# EAGLE schematic BSPD 5 11_27 (EAGLE 8.4.1)
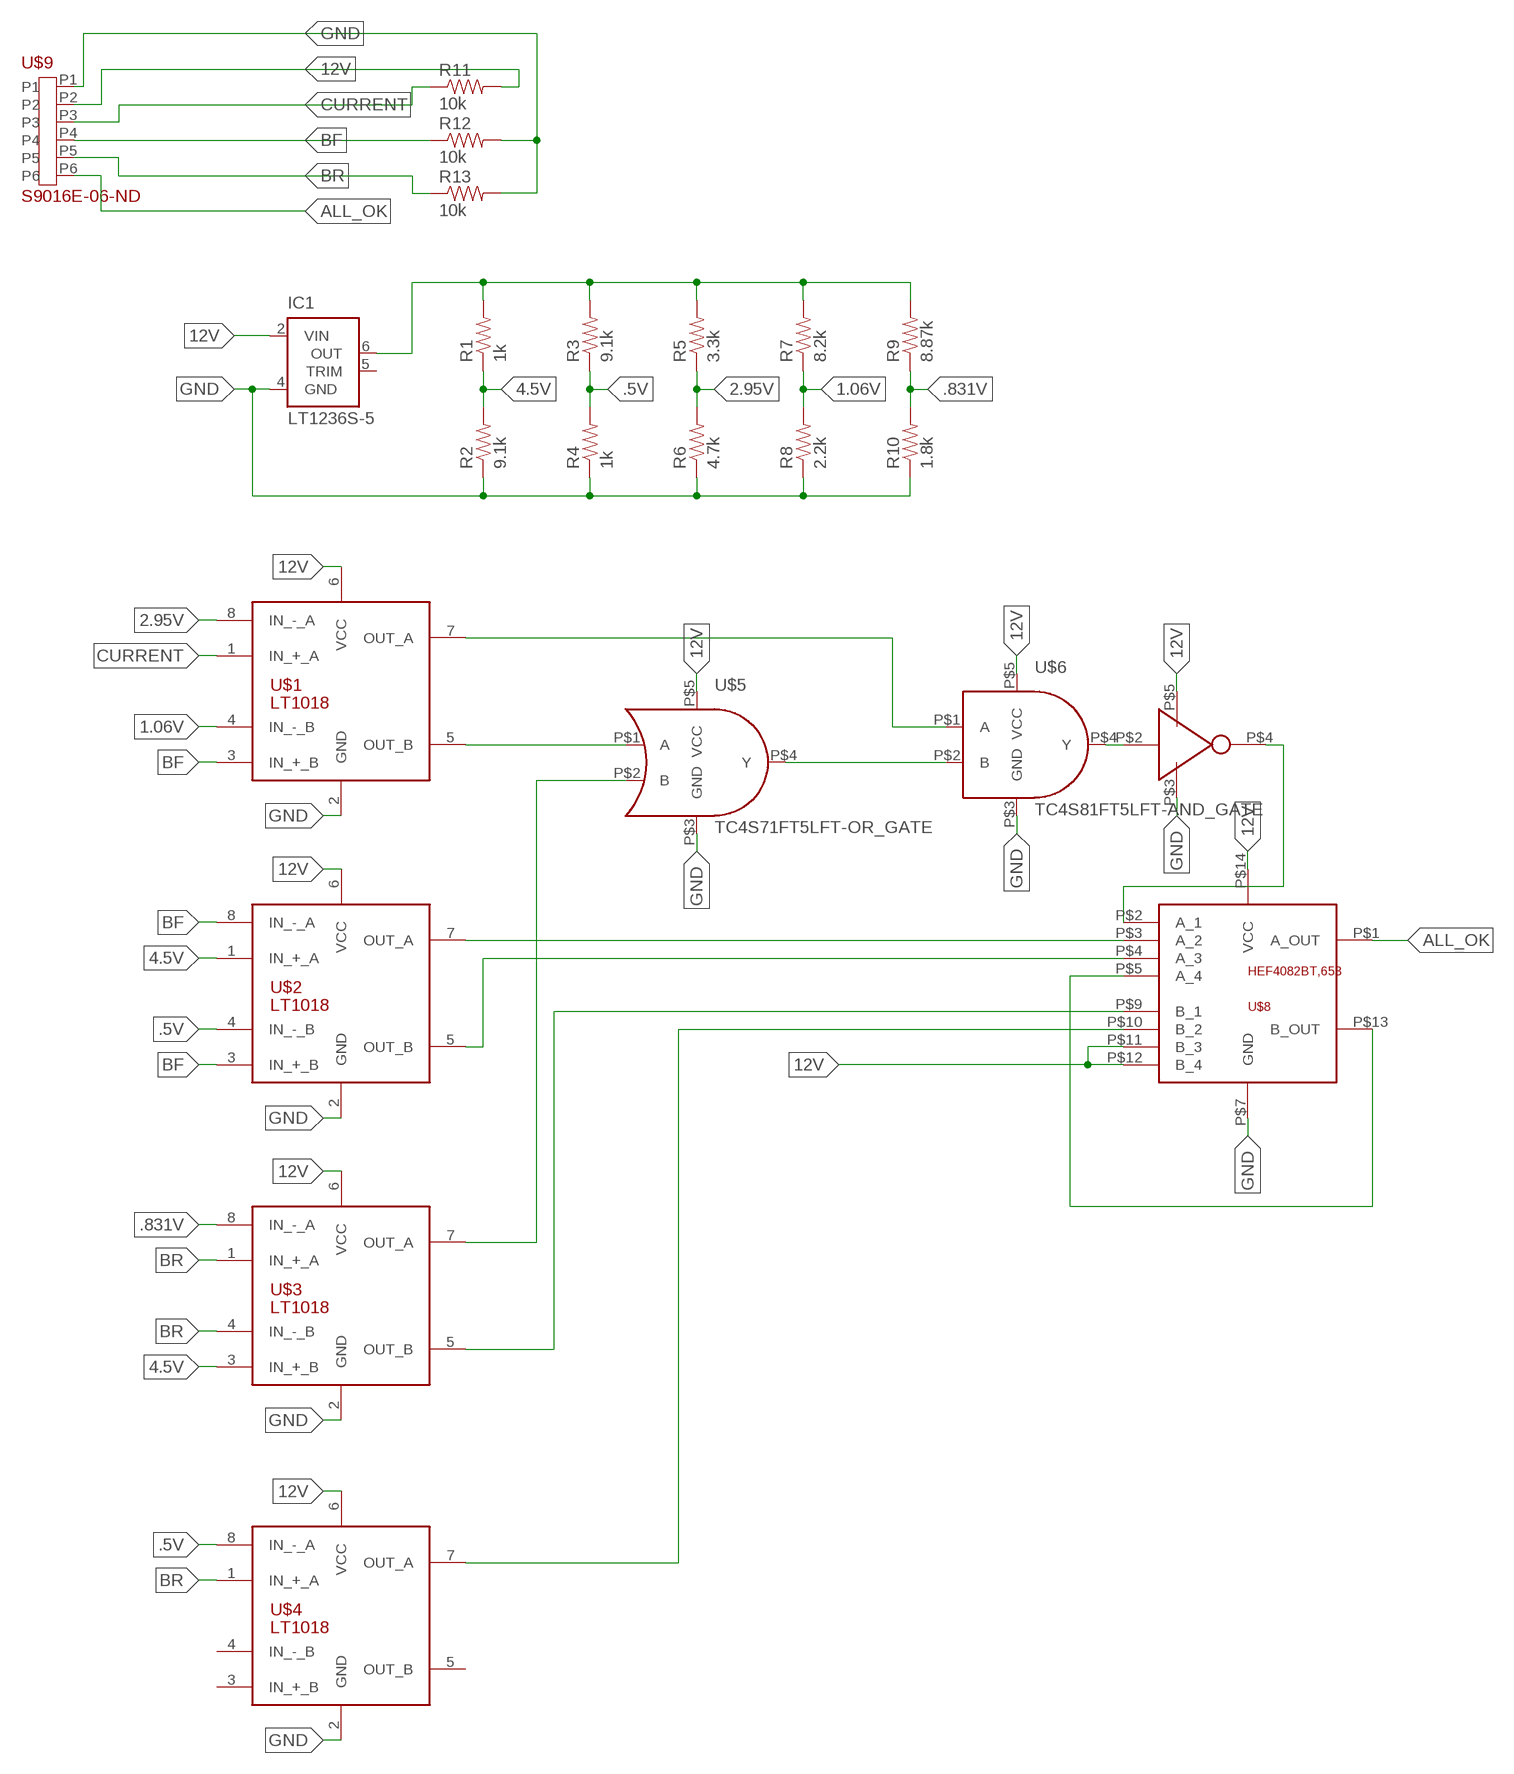
[diagram p0: schematic, sheet 1]

## Parts
IC1  LT1236S-5  [SOIC8]
R1  1k  RESISTOR0603  [0603-RES]
R2  9.1k  RESISTOR0603  [0603-RES]
R3  9.1k  RESISTOR0603  [0603-RES]
R4  1k  RESISTOR0603  [0603-RES]
R5  3.3k  RESISTOR0603  [0603-RES]
R6  4.7k  RESISTOR0603  [0603-RES]
R7  8.2k  RESISTOR0603  [0603-RES]
R8  2.2k  RESISTOR0603  [0603-RES]
R9  8.87k  RESISTOR0603  [0603-RES]
R10  1.8k  RESISTOR0603  [0603-RES]
R11  10k  RESISTOR0603  [0603-RES]
R12  10k  RESISTOR0603  [0603-RES]
R13  10k  RESISTOR0603  [0603-RES]
U$1  LT1018  [SOIC8]
U$2  LT1018  [SOIC8]
U$3  LT1018  [SOIC8]
U$4  LT1018  [SOIC8]
U$5  TC4S71FT5LFT-OR_GATE  [SSOP5-P-0.95]
U$6  TC4S81FT5LFT-AND_GATE  [SSOP5-P-0.95]
U$7  TC4S69F(TE85L,F)  [SSOP5-P-0.95]
U$8  HEF4082BT,653  [NXP_14_SOIC]
U$9  S9016E-06-ND  [S9016E-05-ND]

## Nets
1.06V: R7.1 R8.2 U$1.4(IN_-_B)
2.95V: R5.1 R6.2 U$1.8(IN_-_A)
4.5V: R1.1 R2.2 U$2.1(IN_+_A) U$3.3(IN_+_B)
12V: IC1.2(VIN) R11.2 U$1.6(VCC) U$2.6(VCC) U$3.6(VCC) U$4.6(VCC) U$5.P$5(VCC) U$6.P$5(VCC) U$7.P$5(VCC) U$8.P$11(B_3) U$8.P$12(B_4) U$8.P$14(VCC) U$9.P2
.5V: R3.1 R4.2 U$2.4(IN_-_B) U$4.8(IN_-_A)
.831V: R9.1 R10.2 U$3.8(IN_-_A)
ALL_OK: U$8.P$1(A_OUT) U$9.P6
BF: R12.1 U$1.3(IN_+_B) U$2.3(IN_+_B) U$2.8(IN_-_A) U$9.P4
BR: R13.1 U$3.1(IN_+_A) U$3.4(IN_-_B) U$4.1(IN_+_A) U$9.P5
CURRENT: R11.1 U$1.1(IN_+_A) U$9.P3
GND: IC1.4(GND) R2.1 R4.1 R6.1 R8.1 R10.1 R12.2 R13.2 U$1.2(GND) U$2.2(GND) U$3.2(GND) U$4.2(GND) U$5.P$3(GND) U$6.P$3(GND) U$7.P$3(GND) U$8.P$7(GND) U$9.P1
N$1: IC1.6(OUT) R1.2 R3.2 R5.2 R7.2 R9.2
N$2: U$1.5(OUT_B) U$5.P$1(A)
N$3: U$3.7(OUT_A) U$5.P$2(B)
N$4: U$5.P$4(Y) U$6.P$2(B)
N$5: U$1.7(OUT_A) U$6.P$1(A)
N$6: U$6.P$4(Y) U$7.P$2(IN)
N$7: U$7.P$4(OUT) U$8.P$2(A_1)
N$8: U$2.7(OUT_A) U$8.P$3(A_2)
N$9: U$2.5(OUT_B) U$8.P$4(A_3)
N$10: U$8.P$5(A_4) U$8.P$13(B_OUT)
N$11: U$3.5(OUT_B) U$8.P$9(B_1)
N$12: U$4.7(OUT_A) U$8.P$10(B_2)
Unconnected: IC1.5(TRIM) U$4.3(IN_+_B) U$4.4(IN_-_B) U$4.5(OUT_B)

## Library data of the parts
IC1 = linear-technology:LT1236?*: Precision Voltage Reference Source: http://www.linear.com/pc/downloadDocument.do?navId=H0,C1,C1154,C1002,C1243,P1156,D2948; OC_FARNELL: unknown; OC_NEWARK: unknown
R1-R13 = SparkFun-Resistors:RESISTOR: Resistor Basic schematic elements and footprints for 0603, 1206, and PTH resistors.
U$1-U$4 = linear-technology:LT1018
U$5 = formula electric:TC4S71FT5LFT-OR_GATE
U$6 = formula electric:TC4S81FT5LFT-AND_GATE: TC4S81FT5LFTCT-ND
U$7 = formula electric:TC4S69F(TE85L,F)
U$8 = formula electric:HEF4082BT,653: 568-7702-1-ND
U$9 = S9016E-06-ND:S9016E-06-ND